# EAGLE design usb_shield (EAGLE 6.5.0)
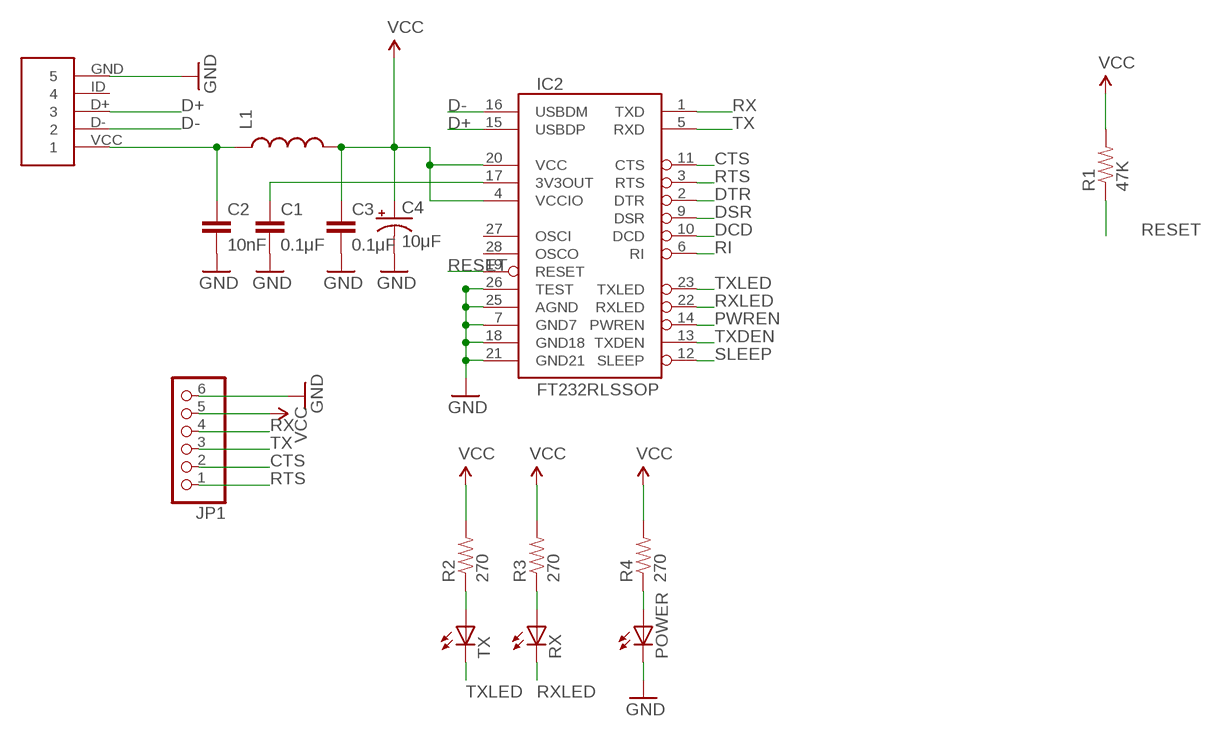
[diagram p0: schematic, sheet 1]

## Parts
C1  0.1μF  CAP0603-CAP  [0603-CAP]
C2  10nF  CAP0603-CAP  [0603-CAP]
C3  0.1μF  CAP0603-CAP  [0603-CAP]
C4  10μF  CAP_POL1206  [EIA3216]
IC2  FT232RLSSOP  [SSOP28DB]
JP1  PINHD-1X6  [1X06]
L1  INDUCTOR0603  [0603]
POWER  LEDCHIP-LED0805  [CHIP-LED0805]
R1  47K  RESISTOR0603-RES  [0603-RES]
R2  270  RESISTOR0603-RES  [0603-RES]
R3  270  RESISTOR0603-RES  [0603-RES]
R4  270  RESISTOR0603-RES  [0603-RES]
RX  LEDCHIP-LED0805  [CHIP-LED0805]
TX  LEDCHIP-LED0805  [CHIP-LED0805]
U$1  USB-MICRO-B-FEMALE  [USB-MICRO-B-FEMALE]

## Nets
3.3V: C1.1 IC2.17(3V3OUT)
CTS: IC2.11(CTS) JP1.2
D+: IC2.15(USBDP) U$1.D+
D-: IC2.16(USBDM) U$1.D-
DCD: IC2.10(DCD)
DSR: IC2.9(DSR)
DTR: IC2.2(DTR)
GND: C1.2 C2.2 C3.2 C4.C(-) IC2.7(GND7) IC2.18(GND18) IC2.21(GND21) IC2.25(AGND) IC2.26(TEST) JP1.6 POWER.C U$1.GND
N$1: C2.1 L1.1 U$1.VCC
N$2: R2.1 TX.A
N$5: R3.1 RX.A
N$6: POWER.A R4.1
PWREN: IC2.14(PWREN)
RESET: IC2.19(RESET) R1.1
RI: IC2.6(RI)
RTS: IC2.3(RTS) JP1.1
RX: IC2.1(TXD) JP1.4
RXLED: IC2.22(RXLED) RX.C
SLEEP: IC2.12(SLEEP)
TX: IC2.5(RXD) JP1.3
TXDEN: IC2.13(TXDEN)
TXLED: IC2.23(TXLED) TX.C
VCC: C3.1 C4.A(+) IC2.4(VCCIO) IC2.20(VCC) JP1.5 L1.2 R1.2 R2.2 R3.2 R4.2
Unconnected: IC2.27(OSCI) IC2.28(OSCO) U$1.ID

## Library data of the parts
C1-C3 = SparkFun:CAP: Capacitor Standard 0603 ceramic capacitor, and 0.1" leaded capacitor.
C4 = SparkFun:CAP_POL: Capacitor Polarized These are standard SMD and PTH capacitors. Normally 10uF, 47uF, and 100uF in electrolytic and tantalum varieties. Always verify the external diameter of the through hole cap, it varies with capacity, voltage, and manufacturer. The EIA devices should be standard.
IC2 = SparkFun:FT232RL: USB UART FT232RL 4th Generation USB UART (USB <-> Serial) Controller. Spark Fun Electronics SKU : COM-00650
JP1 = adafruit:PINHD-1X6: PIN HEADER
L1 = SparkFun:INDUCTOR: Inductors Basic Inductor/Choke - 0603 and 1206. Footprints are not proven and vary greatly between part numbers.
POWER RX TX = adafruit:LED: LED OSRAM: - CHIPLED LG R971, LG N971, LY N971, LG Q971, LY Q971, LO R971, LY R971 LH N974, LH R974 LS Q976, LO Q976, LY Q976 LO Q996 - Hyper CHIPLED LW Q18S LB Q993, LB Q99A, LB R99A - SideLED LS A670, LO A670, LY A670, LG A670, LP A670 LB A673, LV A673, LT A673, LW A673 LH A674 LY A675 LS A676, LA A676, LO A676, LY A676, LW A676 LS A679, LY A679, LG A679 - Hyper Micro SIDELED® LS Y876, LA Y876, LO Y876, LY Y876 LT Y87S - SmartLED LW L88C, LW L88S LB L89C, LB L89S, LG L890 LS L89K, LO L89K, LY L89K LS L896, LA L896, LO L896, LY L896 - TOPLED LS T670, LO T670, LY T670, LG T670, LP T670 LSG T670, LSP T670, LSY T670, LOP T670, LYG T670 LG T671, LOG T671, LSG T671 LB T673, LV T673, LT T673, LW T673 LH T674 LS T676, LA T676, LO T676, LY T676, LB T676, LH T676, LSB T676, LW T676 LB T67C, LV T67C, LT T67C, LS T67K, LO T67K, LY T67K, LW E67C LS E67B, LA E67B, LO E67B, LY E67B, LB E67C, LV E67C, LT E67C LW T67C LS T679, LY T679, LG T679 LS T770, LO T770, LY T770, LG T770, LP T770 LB T773, LV T773, LT T773, LW T773 LH T774 LS E675, LA E675, LY E675, LS T675 LS T776, LA T776, LO T776, LY T776, LB T776 LHGB T686 LT T68C, LB T68C - Hyper Mini TOPLED® LB M676 - Mini TOPLED Santana® LG M470 LS M47K, LO M47K, LY M47K Source: http://www.osram.convergy.de/
R1-R4 = SparkFun:RESISTOR: Resistor Basic schematic elements and footprints for 0603, 1206, and PTH resistors.
U$1 = gclue:USB-MICRO-B-FEMALE

## Board
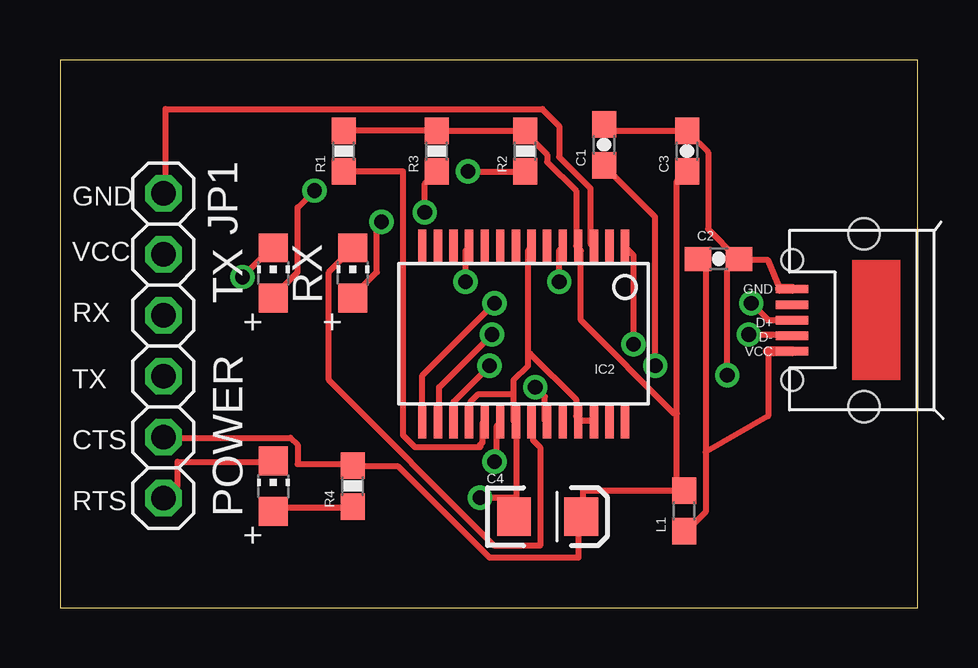
[diagram p1: board, top side]
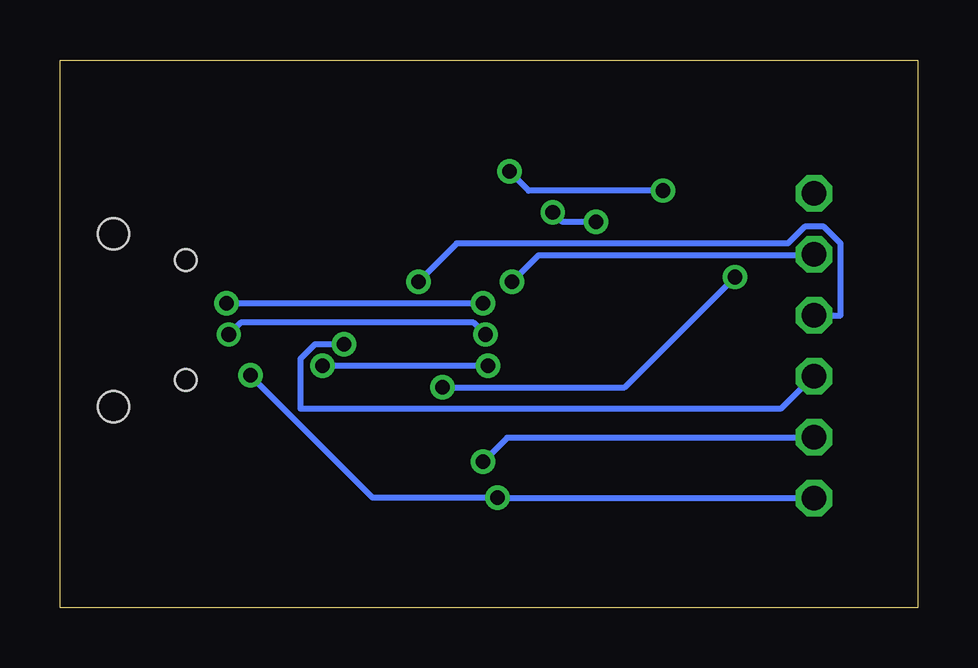
[diagram p2: board, bottom side, seen from below]

Size 35.73 x 22.85 mm. Coordinates in mm from the lower left corner, seen from the top.
Outline: 0,0 35.73,0 35.73,22.85 0,22.85 0,0
Copper layers (1*16): Top 0.035mm / dielectric 1.5mm / Bottom 0.035mm
Design rules "default": minimum track width 10mil, minimum drill 24mil, track to track 8mil, track to pad 8mil, pad to pad 8mil, via to via 8mil, smd to smd 8mil, copper to edge 40mil, drill to drill 8mil, minimum pad ring 10mil, minimum via ring 8mil, stop-mask expansion 4mil, vias tented up to drill 0mil, thermal gap 10mil

### Footprints (pad centres in the part's own frame; a part is rotated, then mirrored left to right if it is on the bottom)
0603-CAP = smd 1.1 x 1: 1 -0.85,0; 2 0.85,0
EIA3216 = smd 1.4 x 1.6: A 1.4,0; C -1.4,0
SSOP28DB = smd 0.348 x 1.397: 1 -4.225,-3.656; 2 -3.575,-3.656; 3 -2.925,-3.656; 4 -2.275,-3.656; 5 -1.625,-3.656; 6 -0.975,-3.656; 7 -0.325,-3.656; 8 0.325,-3.656; 9 0.975,-3.656; 10 1.625,-3.656; 11 2.275,-3.656; 12 2.925,-3.656; 13 3.575,-3.656; 14 4.225,-3.656; 15 4.225,3.656; 16 3.575,3.656; 17 2.925,3.656; 18 2.275,3.656; 19 1.625,3.656; 20 0.975,3.656; 21 0.325,3.656; 22 -0.325,3.656; 23 -0.975,3.656; 24 -1.625,3.656; 25 -2.275,3.656; 26 -2.925,3.656; 27 -3.575,3.656; 28 -4.225,3.656
1X06 = drill 1.016 octagon: 1 -6.35,0; 2 -3.81,0; 3 -1.27,0; 4 1.27,0; 5 3.81,0; 6 6.35,0
0603 = smd 1.1 x 1: 1 -0.85,0; 2 0.85,0
CHIP-LED0805 = smd 1.2 x 1.2: A 0,-1.05; C 0,1.05
0603-RES = smd 1.1 x 1: 1 -0.85,0; 2 0.85,0
USB-MICRO-B-FEMALE = smd 1.35 x 0.35: D+ 3,0; D- 3,0.65; GND 3,-1.3; ID 3,-0.65; VCC 3,1.3 | hole 1.3: 0,3.6; 0,-3.6 | hole 0.9: 3,2.5; 3,-2.5

### Placement (x,y rotation side)
C1  22.67,19.31 90 top
C2  27.44,14.55 0 top
C3  26.13,19.05 90 top
C4  20.32,3.81 0 top
IC2  19.32,11.43 180 top
JP1  4.31,10.93 270 top
L1  26.01,4.05 90 top
POWER  8.89,5.08 0 top
R1  11.82,19.05 90 top
R2  19.39,19.05 90 top
R3  15.7,19.05 90 top
R4  12.2,5.08 90 top
RX  12.2,13.97 0 top
TX  8.89,13.97 0 top
U$1  33.5,12 180 top

### Tracks (layer width: path | path; a pad name or v marks a point on that pad's centre or on a via)
3.3V  (via drill 0.61)
  Top 0.254: v24.8,10.1 24.8,16.3 22.7,18.4 C1.1 | v17.9,10.1 16.4,8.6 16.4,7.8 IC2.17
  Bottom 0.254: v17.9,10.1 v24.8,10.1
CTS  (via drill 0.61)
  Top 0.254: v16.9,13.6 16.9,14.9 17,15 IC2.11
  Bottom 0.254: v16.9,13.6 15.8,14.7 4.4,14.7 JP1.2
D+  (via drill 0.61)
  Top 0.254: U$1.D+ 29.5,12 v28.8,12.7 | v18.1,12.7 15.1,9.7 15.1,7.8 IC2.15
  Bottom 0.254: v18.1,12.7 v28.8,12.7
D-  (via drill 0.61)
  Top 0.254: v28.7,11.4 30.5,11.4 U$1.D- | v18,11.4 15.8,9.2 15.8,7.8 IC2.16
  Bottom 0.254: v28.7,11.4 28.2,11.9 18.5,11.9 v18,11.4
GND  (via drill 0.61)
  Top 0.254: C1.2 22.7,20.1 22.7,19.9 C3.2 26.2,19.8 27,19 27,15.8 28.2,14.6 C2.2 28.2,14.5 27.8,14.1 v27.8,9.7 | POWER.C 8.8,6.1 4.9,6.1 4.9,5.1 4.4,4.6 JP1.6 | IC2.26 22.2,7.8 21.6,7.8 IC2.25 21.6,7.9 21.5,8 21.5,8.7 19.6,10.6 19.5,10.6 | 18.9,8.9 17.4,8.9 17.1,8.6 17.1,7.8 IC2.18 | 18.9,8.9 18.9,7.8 IC2.21 19,7.7 19,3.9 C4.C 18.9,4.6 v17.5,4.6 | 19.5,10.6 19.5,10.1 18.9,9.5 18.9,8.9 | 19.5,10.6 19.5,14.9 19.6,15 IC2.7 | 30,13.3 29.5,14.5 28.29,14.5
  Top 0.406: U$1.GND 30,13.3 | 28.29,14.5 C2.2
  Bottom 0.254: JP1.6 4.4,4.6 v17.5,4.6 22.7,4.6 v27.8,9.7
N$1
  Top 0.254: 26.9,6.5 26.9,14.2 26.6,14.5 C2.1 | 26.9,6.5 26.9,4 26.1,3.2 L1.1 | 29.5,10.7 29.5,8 26.9,6.5
  Top 0.406: U$1.VCC 29.5,10.7
N$2  (via drill 0.61)
  Top 0.254: v17,18.2 R2.1 | v10.6,17.4 9.9,16.7 9.9,14 8.9,13 TX.A
  Bottom 0.254: v17,18.2 16.2,17.4 v10.6,17.4
N$5  (via drill 0.61)
  Top 0.254: R3.1 15.2,17.7 v15.2,16.5 | v13.4,16.1 13.2,15.9 13.2,14 12.2,13 RX.A
  Bottom 0.254: v15.2,16.5 14.8,16.1 v13.4,16.1
N$6
  Top 0.254: R4.1 12.2,4.2 8.9,4.2 8.9,4.1 POWER.A
RESET
  Top 0.254: R1.1 14.3,18.2 14.3,7.2 14.8,6.7 17.5,6.7 17.5,6.8 17.6,6.9 17.6,7.7 IC2.19
RTS
  Top 0.254: IC2.3 22.2,15.1 22.1,15.2 22.1,17.5 20.8,18.8 20.8,20.1 20.1,20.8 4.4,20.8 4.4,17.3 JP1.1
RX  (via drill 0.61)
  Top 0.254: v23.9,11 23.9,14.7 23.6,15 IC2.1
  Bottom 0.254: v23.9,11 25.1,11 25.7,10.4 25.7,8.3 5.7,8.3 4.4,9.6 JP1.4
RXLED
  Top 0.254: RX.C 12.2,15 11.2,14 11.2,9.5 18.1,2.6 20,2.6 20,6.7 19.7,7 19.7,7.7 IC2.22
TX  (via drill 0.61)
  Top 0.254: v20.8,13.6 20.8,14.9 20.9,15 IC2.5
  Bottom 0.254: v20.8,13.6 19.2,15.2 5.4,15.2 4.7,15.9 3.9,15.9 3.2,15.2 3.2,12.2 JP1.3
TXLED  (via drill 0.61)
  Top 0.254: v7.6,13.8 8.8,15 TX.C | v19.8,9.2 20.2,8.8 20.2,7.8 IC2.23
  Bottom 0.254: v7.6,13.8 12.2,9.2 v19.8,9.2
VCC  (via drill 0.61)
  Top 0.254: JP1.5 4.4,7.1 9.6,7.1 9.9,6.8 9.9,6 12.2,6 R4.2 12.3,5.9 14.1,5.9 17.9,2.1 21.6,2.1 21.6,3.8 C4.A 21.8,3.9 21.8,4.9 L1.2 25.7,5 25.7,8.1 | v18.1,6.1 18.2,6.2 18.2,7.6 18.3,7.7 IC2.20 | R1.2 R3.2 R2.2 19.4,19.8 20.3,18.9 20.3,18.6 21.5,17.4 21.5,15.1 IC2.4 21.6,15 21.7,14.9 21.7,12 25.6,8.1 25.7,8.1 | 25.7,8.1 25.7,17.8 26.1,18.2 C3.1
  Bottom 0.254: v18.1,6.1 17.1,7.1 4.4,7.1 JP1.5
(copper drawn outside any net)
  shapes: Top area x1

### Text on the board
tPlace: GND | VCC | RX | TX | CTS | RTS